# Altium schematic sheet hx711_uno_scheme.SchDoc
size A4
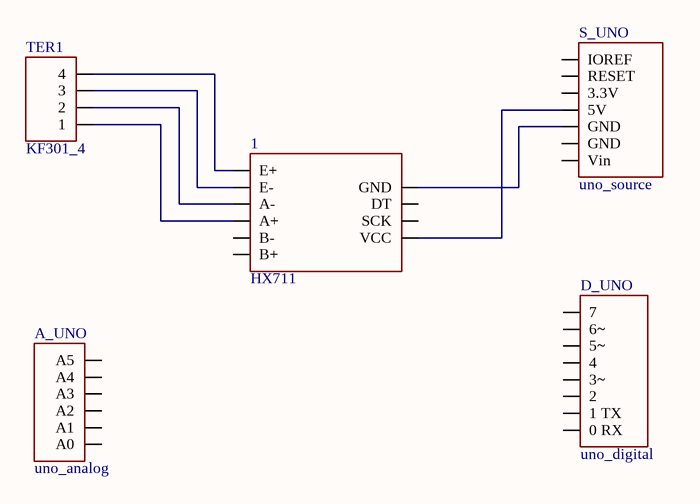
[diagram p0: hx711_uno_scheme.SchDoc]

## Parts
1  HX711  [HX711]
A_UNO  uno_analog  [uno_analog]
D_UNO  uno_digital  [uno_digital]
S_UNO  uno_source  [uno_source]
TER1  KF301_4  [KF304_4]

## Nets
Net1_1: 1.1(E+) TER1.4
Net1_2: 1.2(E-) TER1.3
Net1_3: 1.3(A-) TER1.2
Net1_4: 1.4(A+) TER1.1
Net1_7: 1.7(GND) S_UNO.2(GND)
Net1_10: 1.10(VCC) S_UNO.3(5V)

Not connected (* = marked no-connect by the designer): 1 5(B-) 6(B+) 8(DT) 9(SCK); A_UNO 0(A0) 1(A1) 2(A2) 3(A3) 4(A4) 5(A5); D_UNO 0(0_RX) 1(1_TX_) 2 3(3~) 4 6(6~) 7 ?1(5~); S_UNO 0(Vin) 1(GND) 4(3.3V) 5(RESET) 6(IOREF)